# Altium schematic sheet PowerCable.SchDoc: Power Cable
size A4; CompanyName: UofT Capstone Team 2024991; DrawnBy: Tony Kim; Revision: 1; SheetNumber: 3; SheetTotal: 3
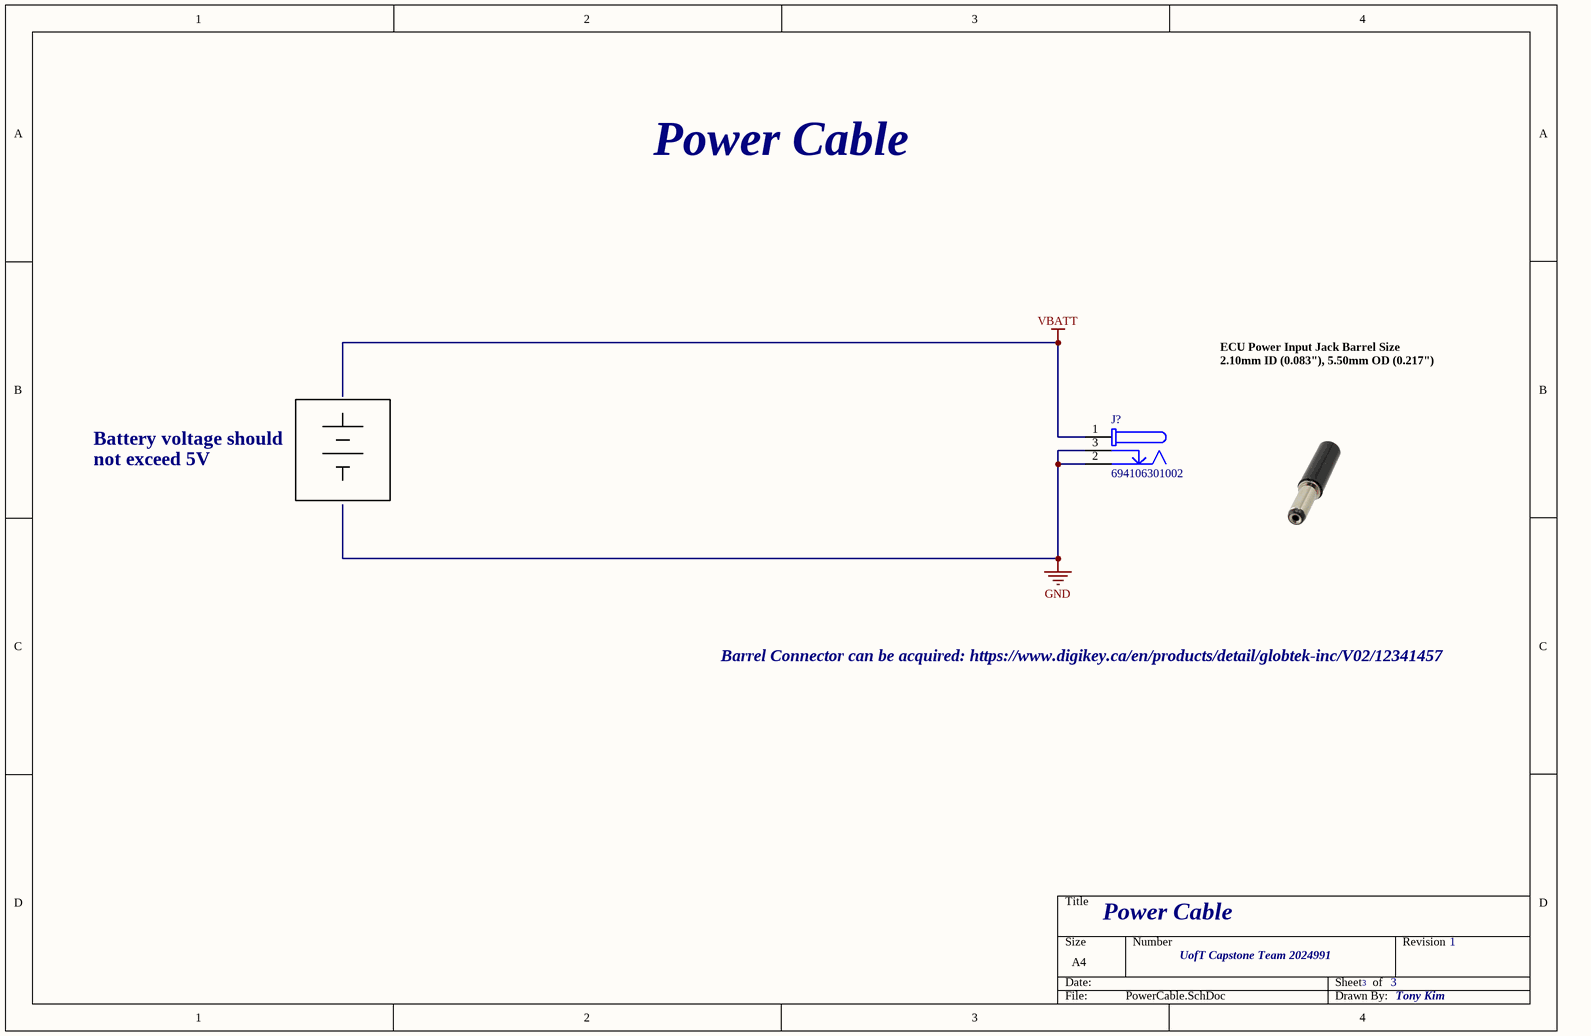
[diagram p0: PowerCable.SchDoc]

## Parts
J?  694106301002  [694106301002]

## Nets
GND: J?.2 J?.3
VBATT: J?.1

## Notes on the sheet
- Power Cable
- 2.10mm ID (0.083"), 5.50mm OD (0.217")
- ECU Power Input Jack Barrel Size
- Battery voltage should
- not exceed 5V
- Barrel Connector can be acquired: https://www.digikey.ca/en/products/detail/globtek-inc/V02/12341457

## Library data of the parts
J? = CMP-1502-00188-2: NexarPartId: 52676100; Voltage Rating (DC): 20V; Gender: Male; Voltage Rating: 24V; Connector Type: Power; Insulation Resistance: 100MΩ; Current Rating: 5A; Shielding: Unshielded; Number of Contacts: 3; Color: Black; Housing Material: Polyamide; Contact Gender: Female; REACH SVHC: Unknown; Termination: Through Hole; Height: 11mm; RoHS: Compliant; Mount: Through Hole; Flammability Rating: UL94 V-0; Packaging: Bulk; Min Operating Temperature: -40°C; Contact Plating: Tin; Max Operating Temperature: 85°C; Operating Supply Voltage: 24V; Contact Material: Gold, Tin